# EAGLE design Infineo (EAGLE 6.6.0)
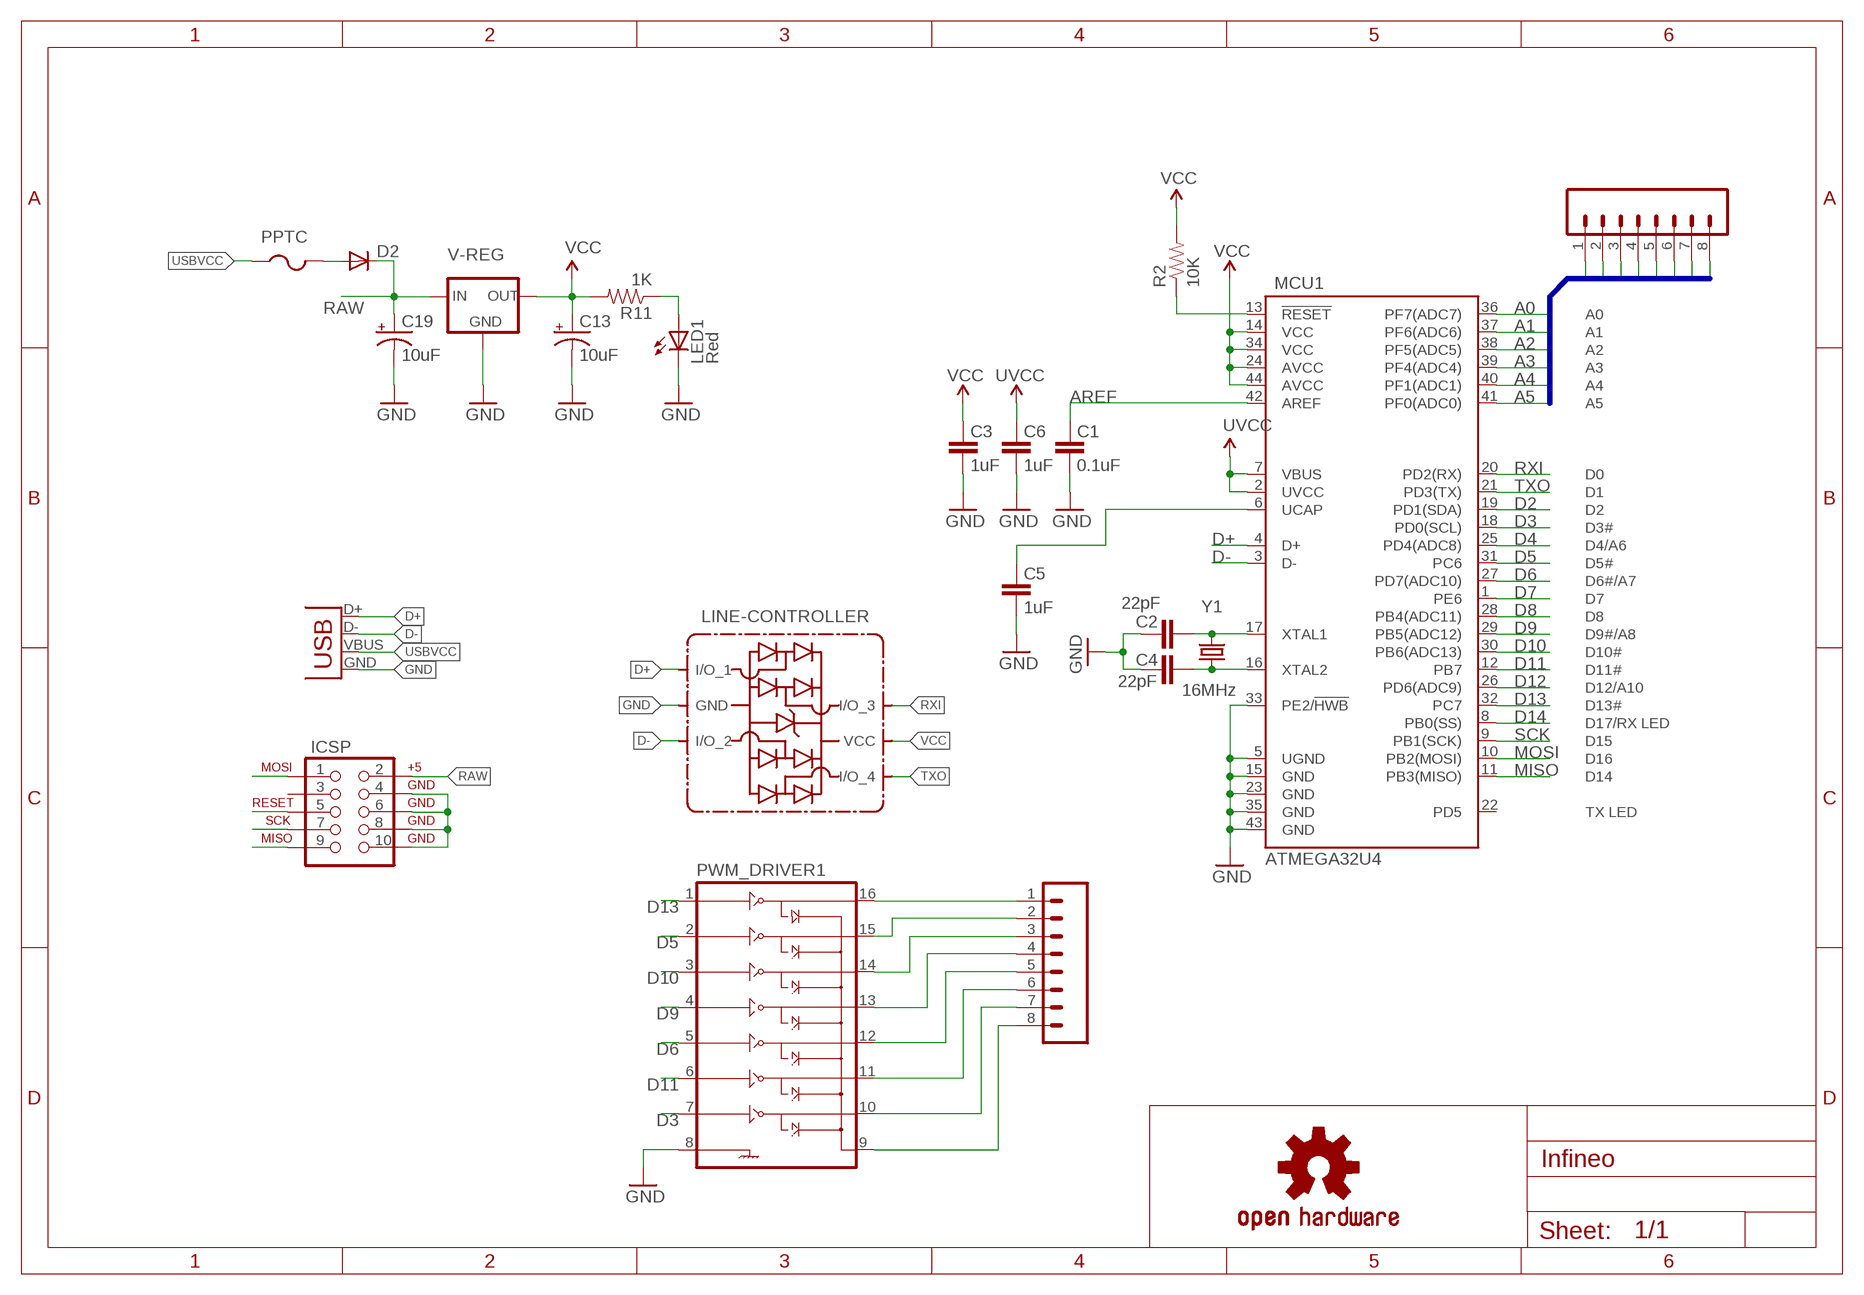
[diagram p0: schematic, sheet 1]

## Parts
C1  0.1uF  CAP0603-CAP  [0603-CAP]
C2  22pF  CAP0603-CAP  [0603-CAP]
C3  1uF  CAP0603-CAP  [0603-CAP]
C4  22pF  CAP0603-CAP  [0603-CAP]
C5  1uF  CAP0603-CAP  [0603-CAP]
C6  1uF  CAP0603-CAP  [0603-CAP]
C13  10uF  CAP_POL1206  [EIA3216]
C19  10uF  CAP_POL1206  [EIA3216]
D2  DIODESOD  [SOD-323]
ICSP  AVR_SPI_PROG2LOCK  [2X5-SHROUDED_LOCK]
JP1  M08LOCK_LONGPADS  [1X08_LOCK_LONGPADS]
JP3  M08LOCK_LONGPADS  [1X08_LOCK_LONGPADS]
LED1  Red  LED0603  [LED-0603]
LINE-CONTROLLER  SP3004_04XTG  [SOT-563]
MCU1  ATMEGA32U4  ATMEGA32U4TQFP  [SPARKFUN-DIGITALIC_TQFP44]
PPTC  PTCFUSE-1206  [R1206]
PWM_DRIVER1  IC_ULN2003-TSSOP-16  [TSSOP-16]
R2  10K  RESISTOR0603-RES  [0603-RES]
R11  1K  RESISTOR0603-RES  [0603-RES]
U$3  OSHW-LOGOS  [OSHW-LOGO-S]
V-REG  LM1117  [SOT223]
X3  USB-B-H  [USB-B-H]
Y1  16MHz  CRYSTALHC49UP  [HC49UP]

## Nets
3.3V: C3.2 ; supply symbol labelled VCC
!RESET: ICSP.5 MCU1.13(!RESET) R2.1
A0: JP1.2 MCU1.36(PF7(ADC7))
A1: JP1.3 MCU1.37(PF6(ADC6))
A2: JP1.4 MCU1.38(PF5(ADC5))
A3: JP1.5 MCU1.39(PF4(ADC4))
A4: JP1.6 MCU1.40(PF1(ADC1))
A5: JP1.7 MCU1.41(PF0(ADC0))
AREF: C1.2 MCU1.42(AREF)
D2: MCU1.19(PD1(SDA))
D3: MCU1.18(PD0(SCL)) PWM_DRIVER1.7(7B)
D4: MCU1.25(PD4(ADC8))
D5: MCU1.31(PC6) PWM_DRIVER1.2(2B)
D6: MCU1.27(PD7(ADC10)) PWM_DRIVER1.5(5B)
D7: MCU1.1(PE6)
D8: MCU1.28(PB4(ADC11))
D9: MCU1.29(PB5(ADC12)) PWM_DRIVER1.4(4B)
D10: MCU1.30(PB6(ADC13)) PWM_DRIVER1.3(3B)
D11: MCU1.12(PB7) PWM_DRIVER1.6(6B)
D12: MCU1.26(PD6(ADC9))
D13: MCU1.32(PC7) PWM_DRIVER1.1(1B)
D14: ICSP.9 MCU1.11(PB3(MISO))
D+: LINE-CONTROLLER.I/O_1 MCU1.4(D+) X3.D+
D-: LINE-CONTROLLER.I/O_2 MCU1.3(D-) X3.D-
GND [vcc]: C1.1 C2.2 C3.1 C4.2 C5.1 C6.1 C13.C(-) C19.C(-) ICSP.4 ICSP.6 ICSP.8 ICSP.10 JP1.8 LED1.C LINE-CONTROLLER.GND MCU1.5(UGND) MCU1.15(GND) MCU1.23(GND) MCU1.33(PE2/!HWB) MCU1.35(GND) MCU1.43(GND) PWM_DRIVER1.8(GND) V-REG.1(GND) X3.GND
MISO: MCU1.8(PB0(SS))
MOSI: ICSP.1 MCU1.10(PB2(MOSI))
N$1: C4.1 MCU1.16(XTAL2) Y1.1
N$2: C2.1 MCU1.17(XTAL1) Y1.2
N$3: D2.2(A) PPTC.2
N$4: C5.2 MCU1.6(UCAP)
N$9: JP3.1 PWM_DRIVER1.16(1C)
N$10: JP3.2 PWM_DRIVER1.15(2C)
N$11: JP3.3 PWM_DRIVER1.14(3C)
N$12: JP3.4 PWM_DRIVER1.13(4C)
N$13: JP3.5 PWM_DRIVER1.12(5C)
N$14: JP3.6 PWM_DRIVER1.11(6C)
N$15: JP3.7 PWM_DRIVER1.10(7C)
N$16: JP3.8 PWM_DRIVER1.9(COM)
N$38: LED1.A R11.1
RAW [vcc]: C19.A(+) D2.1(C) ICSP.2 V-REG.3(IN)
RXI: LINE-CONTROLLER.I/O_3 MCU1.20(PD2(RX))
SCK: ICSP.7 MCU1.9(PB1(SCK))
TXO: LINE-CONTROLLER.I/O_4 MCU1.21(PD3(TX))
USBVCC: PPTC.1 X3.VBUS
UVCC: C6.2 MCU1.2(UVCC) MCU1.7(VBUS)
VCC: C13.A(+) JP1.1 LINE-CONTROLLER.VCC MCU1.14(VCC) MCU1.24(AVCC) MCU1.34(VCC) MCU1.44(AVCC) R2.2 R11.2 V-REG.2(OUT)
Unconnected: ICSP.3 MCU1.22(PD5)

## Buses
A[0..5],VCC,GND

## Library data of the parts
C1-C6 = SparkFun:CAP: Capacitor Standard 0603 ceramic capacitor, and 0.1" leaded capacitor.
C13 C19 = SparkFun:CAP_POL: Capacitor Polarized These are standard SMD and PTH capacitors. Normally 10uF, 47uF, and 100uF in electrolytic and tantalum varieties. Always verify the external diameter of the through hole cap, it varies with capacity, voltage, and manufacturer. The EIA devices should be standard.
D2 = SparkFun:DIODE: Diode These are standard reverse protection diodes and small signal diodes. SMA package can handle up to about 1A. SOD-323 can handle about 200mA. What the SOD-323 package when ordering, there are some mfgs out there that are 5-pin packages.
ICSP = SparkFun:AVR_SPI_PROG2: AVR ICSP Header This is the standard AVR In Circuit Serial Programming header. Minimal, but includes pin one indicator. Works with standard Olimex programmers. Also look for the 6-pin reduced version. Spark Fun Electronics SKU: PRT-00778
JP1 JP3 = SparkFun-Connectors:M08: Header 8 Standard 8-pin 0.1" header. Use with straight break away headers (SKU : PRT-00116), right angle break away headers (PRT-00553), swiss pins (PRT-00743), machine pins (PRT-00117), and female headers (PRT-00115).
LED1 = SparkFun:LED: LEDs Standard schematic elements and footprints for 5mm, 3mm, 1206, and 0603 sized LEDs. 5mm - Spark Fun Electronics SKU : COM-00529 (and others)
LINE-CONTROLLER = SP3004:SP3004
MCU1 = SparkFun-Retired:ATMEGA32U4: Atmel 44-pin 8-bit Microcontroller with 32KBytes of ISP Flash and USB Controller ----- Please use the QFN-44-NOPAD_1:1 package for the footprint of all boards using a 32U4. Route traces directly away from the pads as much as possible.; PROD_ID: IC-11161
PPTC = adafruit:PTCFUSE: PTC fuses, resettable thermistors
PWM_DRIVER1 = dp_devices:IC_ULN2003: 7 Darlington Array Driver
R2 R11 = SparkFun:RESISTOR: Resistor Basic schematic elements and footprints for 0603, 1206, and PTH resistors.
U$3 = SparkFun:OSHW-LOGO: Open Source Hardware Logo This logo indicates the piece of hardware it is found on incorporates a OSHW license and/or adheres to the definition of open source hardware found here: http://freedomdefined.org/OSHW
V-REG = v-reg-2:LM1117
X3 = con-usb:USB: USB Connectors
Y1 = crystal:CRYSTAL: CRYSTAL; OC_FARNELL: unknown; OC_NEWARK: unknown

## Net classes
0 default: width 0.203 mm

## Board
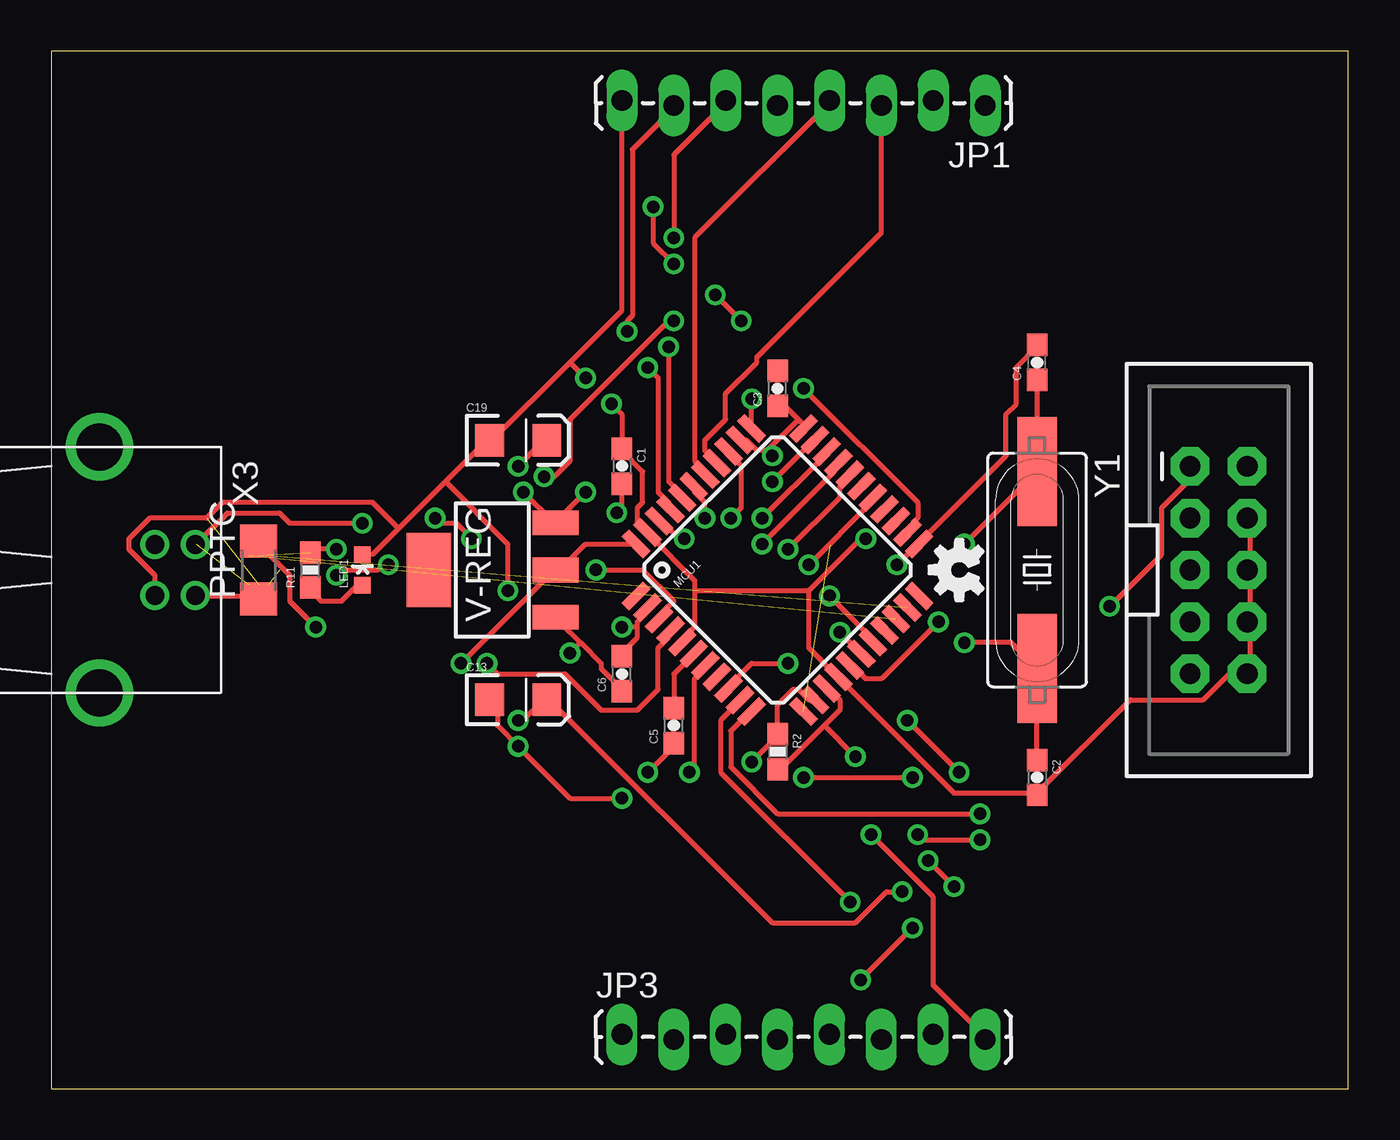
[diagram p1: board, top side]
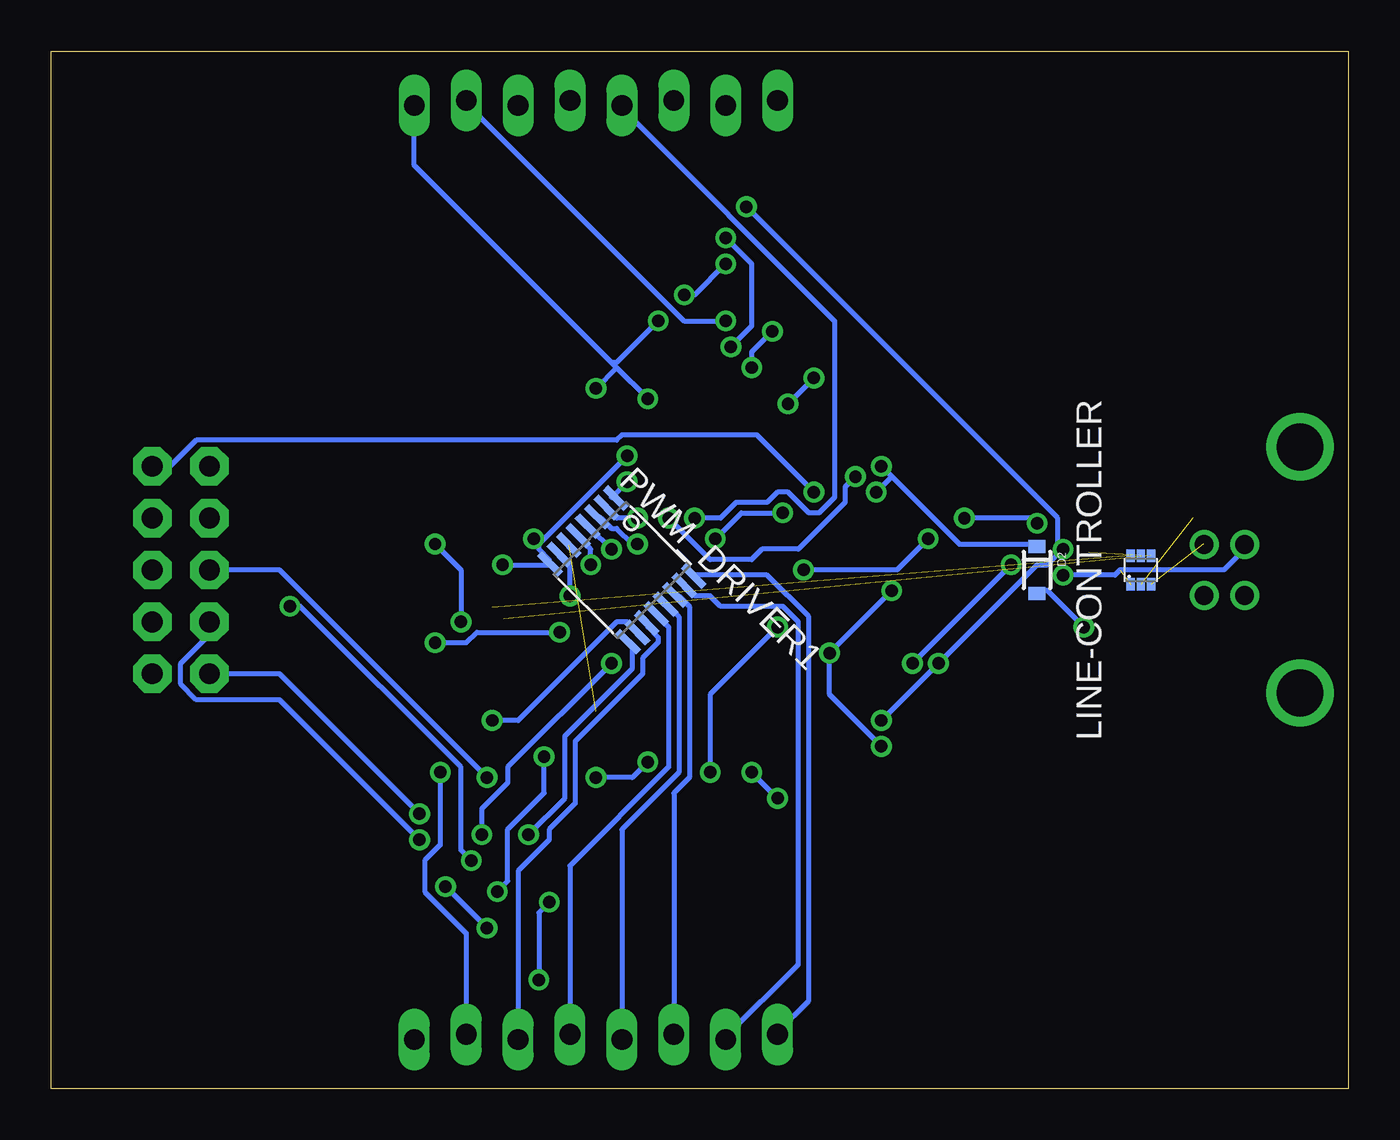
[diagram p2: board, bottom side, seen from below]

Size 63.5 x 50.8 mm. Coordinates in mm from the lower left corner, seen from the top.
Outline: 0,0 63.5,0 63.5,50.8 0,50.8 0,0
Copper layers (1*16): Top 0.035mm / dielectric 1.5mm / Bottom 0.035mm
Design rules "default": minimum track width 10mil, minimum drill 24mil, track to track 8mil, track to pad 8mil, pad to pad 8mil, via to via 8mil, smd to smd 8mil, copper to edge 40mil, drill to drill 8mil, minimum pad ring 10mil, minimum via ring 8mil, stop-mask expansion 4mil, vias tented up to drill 0mil, thermal gap 10mil

### Footprints (pad centres in the part's own frame; a part is rotated, then mirrored left to right if it is on the bottom)
0603-CAP = smd 1.1 x 1: 1 -0.85,0; 2 0.85,0
EIA3216 = smd 1.4 x 1.6: A 1.4,0; C -1.4,0
SOD-323 = smd 0.63 x 0.83: 1 -1.15,0; 2 1.15,0
2X5-SHROUDED_LOCK = drill 1.016 pad 1.88 octagon: 1 -1.397,5.08; 2 1.397,5.08; 3 -1.397,2.54; 4 1.397,2.54; 5 -1.397,0; 6 1.397,0; 7 -1.397,-2.54; 8 1.397,-2.54; 9 -1.397,-5.08; 10 1.397,-5.08
1X08_LOCK_LONGPADS = drill 1.016 long: 1 0,0.127; 2 2.54,-0.127; 3 5.08,0.127; 4 7.62,-0.127; 5 10.16,0.127; 6 12.7,-0.127; 7 15.24,0.127; 8 17.78,-0.127
LED-0603 = smd 0.8 x 0.8: A 0,-0.75; C 0,0.75
SOT-563 = smd 0.6 x 0.4: GND -0.7,0; I/O_1 -0.7,0.5; I/O_2 -0.7,-0.5; I/O_3 0.7,-0.5; I/O_4 0.7,0.5; VCC 0.7,0
SPARKFUN-DIGITALIC_TQFP44 = smd 1.5 x 0.5: 1 -5.8,4; 2 -5.8,3.2; 3 -5.8,2.4; 4 -5.8,1.6; 5 -5.8,0.8; 6 -5.8,0; 7 -5.8,-0.8; 8 -5.8,-1.6; 9 -5.8,-2.4; 10 -5.8,-3.2; 11 -5.8,-4; 23 5.8,-4; 24 5.8,-3.2; 25 5.8,-2.4; 26 5.8,-1.6; 27 5.8,-0.8; 28 5.8,0; 29 5.8,0.8; 30 5.8,1.6; 31 5.8,2.4; 32 5.8,3.2; 33 5.8,4 | smd 0.5 x 1.5: 12 -4,-5.8; 13 -3.2,-5.8; 14 -2.4,-5.8; 15 -1.6,-5.8; 16 -0.8,-5.8; 17 0,-5.8; 18 0.8,-5.8; 19 1.6,-5.8; 20 2.4,-5.8; 21 3.2,-5.8; 22 4,-5.8; 34 4,5.8; 35 3.2,5.8; 36 2.4,5.8; 37 1.6,5.8; 38 0.8,5.8; 39 0,5.8; 40 -0.8,5.8; 41 -1.6,5.8; 42 -2.4,5.8; 43 -3.2,5.8; 44 -4,5.8
R1206 = smd 1.6 x 1.803: 1 -1.422,0; 2 1.422,0
TSSOP-16 = smd 0.35 x 1.43: 1 -2.275,-2.7; 2 -1.625,-2.7; 3 -0.975,-2.7; 4 -0.325,-2.7; 5 0.325,-2.7; 6 0.975,-2.7; 7 1.625,-2.7; 8 2.275,-2.7; 9 2.275,2.7; 10 1.625,2.7; 11 0.975,2.7; 12 0.325,2.7; 13 -0.325,2.7; 14 -0.975,2.7; 15 -1.625,2.7; 16 -2.275,2.7
0603-RES = smd 1.1 x 1: 1 -0.85,0; 2 0.85,0
SOT223 = smd 1.219 x 2.235: 1 -2.311,-3.099; 2 0,-3.099; 3 2.311,-3.099 | smd 3.6 x 2.2: 4 0,3.099
USB-B-H = drill 0.914: D+ 0,1.25; D- 1.981,1.25; GND 0,-1.25; VBUS 1.981,-1.25 | drill 2.286: P$1 -2.718,-6.02; P$2 -2.718,6.02
HC49UP = smd 5.334 x 1.93: 1 -4.826,0; 2 4.826,0

### Placement (x,y rotation side)
C1  27.94,30.48 270 top
C2  48.26,15.24 270 top
C3  35.56,34.29 90 top
C4  48.26,35.56 90 top
C5  30.48,17.78 90 top
C6  27.94,20.32 90 top
C13  22.86,19.05 0 top
C19  22.86,31.75 0 top
D2  15.24,25.4 270 bottom
ICSP  57.15,25.4 0 top
JP1  45.72,48.26 180 top
JP3  27.94,2.54 0 top
LED1  15.24,25.4 0 top
LINE-CONTROLLER  10.16,25.4 90 bottom
MCU1  35.56,25.4 45 top
PPTC  10.16,25.4 90 top
PWM_DRIVER1  35.56,25.4 225 bottom
R2  35.56,16.51 270 top
R11  12.7,25.4 90 top
U$3  44.45,25.4 90 top
V-REG  21.59,25.4 90 top
X3  5.08,25.4 0 top
Y1  48.26,25.4 270 top

### Tracks (layer width: path | path; a pad name or v marks a point on that pad's centre or on a via)
!RESET  (via drill 0.61)
  Top 0.254: v36.83,15.24 v42.16,15.24 | v34.29,16 35.56,17.27 R2.1 35.56,18.8 36.32,19.56 36.58,19.56 37.08,19.05 37.34,19.05 MCU1.13
  Bottom 0.254: ICSP.5 52.32,25.4 v42.16,15.24 | v36.83,15.24 35.05,15.24 v34.29,16
A0  (via drill 0.61)
  Top 0.254: v33.27,27.94 33.78,28.45 33.78,30.48 33.27,30.99 MCU1.36 | v24.13,29.97 24.64,29.97 25.4,30.73 25.4,32.77 29.97,37.34 30.23,37.34 v30.48,37.59
  Bottom 0.254: v33.27,27.94 31.24,25.91 29.21,25.91 28.7,26.42 26.92,26.42 24.64,28.7 24.64,29.46 v24.13,29.97 | v30.48,37.59 32.51,37.59 43.18,48.26 JP1.2
A1
  Top 0.254: JP1.3 40.64,41.91 34.54,35.81 34.54,35.56 33.02,34.04 33.02,32.77 32,31.75 32,31.24 32.51,30.73 MCU1.37
A2
  Top 0.254: MCU1.38 32,30.23 31.5,30.73 31.5,41.66 38.1,48.26 JP1.4
A3  (via drill 0.61)
  Top 0.254: v32,27.94 32,28.7 31.5,29.21 31.5,29.46 MCU1.39
  Bottom 0.254: v32,27.94 30.73,27.94 29.97,28.7 28.45,28.7 27.94,29.21 27.43,29.21 26.42,28.19 25.91,28.19 25.15,28.96 25.15,37.59 35.56,48.01 JP1.5
A4  (via drill 0.61)
  Top 0.254: v30.23,36.32 30.23,29.72 30.99,28.96 MCU1.40 | v30.48,41.66 30.48,45.72 33.02,48.26 JP1.6
  Bottom 0.254: v30.23,36.32 29.21,37.34 29.21,40.39 v30.48,41.66
A5  (via drill 0.61)
  Top 0.254: v29.21,35.31 29.72,34.8 29.72,29.21 30.23,28.7 30.23,28.45 MCU1.41 | v28.19,37.08 28.19,37.59 28.45,37.85 28.45,45.97 30.48,48.01 JP1.7
  Bottom 0.254: v29.21,35.31 29.21,36.07 v28.19,37.08
AREF  (via drill 0.61)
  Top 0.254: C1.2 27.94,28.45 v27.69,28.19 | v30.99,26.92 30.73,26.92 29.97,27.69 MCU1.42
  Bottom 0.254: v27.69,28.19 29.72,28.19 v30.99,26.92
D3  (via drill 0.61)
  Top 0.254: v38.1,24.13 40.13,22.1 MCU1.18
  Bottom 0.254: v38.1,24.13 38.1,25.65 38.61,26.16 PWM_DRIVER1.7
D5  (via drill 0.61)
  Top 0.254: v34.8,27.94 37.85,30.99 MCU1.31
  Bottom 0.254: v34.8,27.94 35.81,27.94 36.32,28.45 PWM_DRIVER1.2
D6  (via drill 0.61)
  Top 0.254: v37.08,25.65 40.13,28.7 MCU1.27
  Bottom 0.254: v37.08,25.65 37.08,26.42 37.59,26.92 PWM_DRIVER1.5
D9  (via drill 0.61)
  Top 0.254: v36.07,26.42 38.61,28.96 38.61,29.46 39.12,29.97 MCU1.29
  Bottom 0.254: v36.07,26.42 37.08,27.43 PWM_DRIVER1.4
D10  (via drill 0.61)
  Top 0.254: v34.8,26.67 38.35,30.23 38.35,30.48 MCU1.30
  Bottom 0.254: v34.8,26.67 35.05,26.67 35.81,27.43 36.07,27.43 36.58,27.94 PWM_DRIVER1.3
D11  (1 unrouted)
D13  (via drill 0.61)
  Top 0.254: v35.31,29.72 37.34,31.75 MCU1.32
  Bottom 0.254: v35.31,29.72 36.07,28.96 PWM_DRIVER1.1
D14  (via drill 0.61)
  Top 0.254: v45.47,13.46 35.56,13.46 33.27,15.75 33.27,17.53 34.04,18.29 MCU1.11
  Bottom 0.254: ICSP.9 52.32,20.32 v45.47,13.46
D+  (via drill 0.61)  (1 unrouted)
  Top 0.254: v21.34,20.83 21.84,20.32 25.15,20.32 26.92,18.54 28.7,18.54 29.72,19.56 29.72,21.59 30.23,22.1 30.23,22.35 MCU1.4 | v16.51,25.65 16.26,25.65 16,25.4 14.22,25.4 v13.97,25.15
  Bottom 0.254: v16.51,25.65 v21.34,20.83 | v13.97,25.15 11.43,25.15 11.18,25.4 6.1,25.4 5.08,26.42 X3.D+
D-  (via drill 0.61)  (1 unrouted)
  Top 0.254: v26.67,25.4 28.96,25.4 30.48,23.88 29.97,23.37 29.97,23.11 MCU1.3 | v20.57,26.92 19.81,27.69 19.05,27.69 v18.8,27.94 | v15.24,27.69 11.68,27.69 11.18,28.19 8.64,28.19 7.11,26.67 X3.D-
  Bottom 0.254: v26.67,25.4 22.1,25.4 v20.57,26.92 | v18.8,27.94 15.49,27.94 v15.24,27.69
GND  (via drill 0.61)  (1 unrouted)
  Top 0.254: 36.58,32.77 36.83,32.51 MCU1.33 | 36.58,32.77 35.81,33.53 35.56,33.53 C3.1 | 35.05,31.24 34.54,31.24 34.04,31.75 33.78,31.75 MCU1.35 | 36.58,32.77 35.05,31.24 | C4.2 48.26,36.32 47.24,35.31 47.24,33.53 46.74,33.02 46.74,30.99 42.67,26.92 MCU1.23 42.42,26.67 v41.4,25.65 | v35.31,30.99 35.05,31.24 | 58.67,22.86 58.67,20.32 ICSP.10 57.66,20.32 56.39,19.05 52.83,19.05 48.26,14.48 | 58.67,25.4 58.67,27.94 ICSP.4 | 58.67,25.4 58.67,22.86 | 58.67,22.86 ICSP.8 | 58.67,25.4 ICSP.6 | 48.26,14.48 44.2,14.48 38.61,20.07 MCU1.15 38.35,20.32 37.08,21.59 37.08,24.38 | 48.26,14.48 C2.2 | v39.88,26.92 39.62,26.92 37.08,24.38 | 25.91,21.84 24.89,22.86 V-REG.1 | 25.91,21.84 26.92,20.83 26.92,20.57 27.94,19.56 C6.1 | v29.21,15.49 30.48,16.76 C5.1 | v27.94,14.22 25.4,14.22 v22.86,16.76 21.84,17.78 21.84,18.8 21.59,19.05 C13.C | v25.4,21.34 25.91,21.84 | 31.5,24.38 31.5,24.89 29.21,27.18 MCU1.43 28.96,27.43 28.7,27.69 28.7,28.45 28.96,28.7 28.96,30.23 27.94,31.24 C1.1 27.94,33.02 v27.43,33.53 | 31.5,24.38 31.5,22.61 30.99,22.1 MCU1.5 | JP1.8 27.94,38.1 25.4,35.56 | 25.4,35.56 21.59,31.75 C19.C 21.34,31.75 19.3,29.72 | 19.3,29.72 17.02,27.43 | 17.02,27.43 15.75,26.16 15.24,26.16 LED1.C | X3.GND 5.08,25.15 3.81,26.42 3.81,26.92 4.83,27.94 7.62,27.94 8.38,28.7 15.75,28.7 17.02,27.43 | 25.4,35.56 v26.16,34.8 | v22.35,24.38 22.35,26.67 19.3,29.72 | 31.5,24.38 37.08,24.38
  Bottom 0.254: v41.4,25.65 39.12,25.65 PWM_DRIVER1.8 39.12,25.91 39.62,26.42 39.62,26.67 | 39.62,26.67 v35.31,30.99 | v39.88,26.92 39.62,26.67 | v27.94,14.22 v29.21,15.49 | v22.86,16.76 25.4,19.3 v25.4,21.34 v22.35,24.38 | v26.16,34.8 v27.43,33.53
MOSI  (via drill 0.61)
  Top 0.254: v51.82,23.62 54.36,26.16 54.36,28.45 55.88,29.97 55.88,30.48 ICSP.1 | v44.2,9.91 v42.93,11.18 | v39.62,5.33 v42.16,7.87 | v39.12,9.14 32.77,15.49 32.77,18.03 33.53,18.8 MCU1.10
  Bottom 0.254: v51.82,23.62 51.31,23.62 43.43,15.75 43.43,11.68 v42.93,11.18 | v42.16,7.87 v44.2,9.91 | v39.62,5.33 39.62,8.64 v39.12,9.14
N$1  (via drill 0.61)
  Top 0.254: C4.1 Y1.1 v44.7,26.67 | v43.43,22.86 40.64,20.07 39.88,20.07 39.12,20.83 MCU1.16
  Bottom 0.254: v43.43,22.86 43.43,25.4 v44.7,26.67
N$2  (via drill 0.61)
  Top 0.254: C2.1 Y1.2 46.99,21.84 v44.7,21.84 | v38.61,22.35 39.62,21.34 MCU1.17
  Bottom 0.254: v38.61,22.35 42.67,22.35 43.18,21.84 v44.7,21.84
N$3  (via drill 0.61)
  Top 0.254: v12.95,22.61 11.68,23.88 11.68,25.15 10.16,26.67 PPTC.2
  Bottom 0.254: v12.95,22.61 14.73,24.38 15.24,24.38 D2.2
N$4
  Top 0.254: C5.2 30.48,20.32 MCU1.6
N$9
  Bottom 0.254: PWM_DRIVER1.16 32,25.15 28.45,25.15 26.42,23.11 26.42,4.32 27.94,2.79 JP3.1
N$10
  Bottom 0.254: PWM_DRIVER1.15 32.51,24.64 32,24.13 31.24,24.13 30.73,23.62 27.69,23.62 26.92,22.86 26.92,6.1 30.48,2.54 JP3.2
N$11
  Bottom 0.254: JP3.3 33.02,14.48 32.26,15.24 32.26,23.62 32.77,24.13 PWM_DRIVER1.14
N$12
  Bottom 0.254: JP3.4 35.56,12.7 32.77,15.49 32.77,23.11 33.27,23.62 PWM_DRIVER1.13
N$13
  Bottom 0.254: JP3.5 38.1,10.92 33.27,15.75 33.27,22.61 33.78,23.11 PWM_DRIVER1.12
N$14
  Bottom 0.254: JP3.6 40.64,10.67 39.12,12.19 39.12,12.7 37.85,13.97 37.85,17.02 34.54,20.32 34.54,21.08 33.78,21.84 33.78,22.1 34.29,22.61 PWM_DRIVER1.11
N$15  (via drill 0.61)
  Top 0.254: v41.91,18.03 v44.45,15.49
  Bottom 0.254: JP3.7 43.18,7.62 45.21,9.65 45.21,11.18 44.45,11.94 v44.45,15.49 | v41.91,18.03 40.64,18.03 35.81,22.86 35.31,22.86 34.8,22.35 PWM_DRIVER1.10
N$16  (via drill 0.61)
  Top 0.254: v40.13,12.45 43.18,9.4 43.18,5.08 45.72,2.54 JP3.8
  Bottom 0.254: v40.13,12.45 38.35,14.22 38.35,17.27 35.05,20.57 35.05,21.59 35.31,21.84 PWM_DRIVER1.9
N$38
  Top 0.254: LED1.A 15.24,24.64 14.99,24.64 14.22,23.88 13.21,23.88 12.7,24.38 R11.1
RAW  (via drill 0.61)
  Top 0.254: v22.86,30.48 24.13,31.75 C19.A | v23.11,29.21 24.64,27.69 V-REG.3 24.89,27.94 v26.16,29.21
  Bottom 0.254: v22.86,30.48 22.35,29.97 | 22.35,29.97 19.05,26.67 15.24,26.67 D2.1 | 22.35,29.97 v23.11,29.21 | ICSP.2 57.66,30.48 56.39,31.75 35.81,31.75 35.56,32 28.96,32 v26.16,29.21
RXI  (1 unrouted)
SCK  (via drill 0.61)
  Top 0.254: v45.47,12.19 42.67,12.19 v42.42,12.45 | v36.07,20.83 34.29,20.83 33.27,19.81 MCU1.9
  Bottom 0.254: v45.47,12.19 52.32,19.05 56.39,19.05 57.15,19.81 57.15,20.83 55.88,22.1 55.88,22.86 ICSP.7 | v42.42,12.45 42.42,13.72 41.15,14.99 41.15,15.75 v36.07,20.83
TXO  (1 unrouted)
USBVCC
  Top 0.254: PPTC.1 10.16,24.13 7.11,24.13 X3.VBUS
UVCC  (via drill 0.61)
  Top 0.254: 28.7,22.61 28.7,22.1 27.94,21.34 C6.2 | 28.7,22.61 28.7,22.86 28.96,23.11 28.96,23.37 MCU1.2 | v31.24,15.49 31.5,15.75 31.5,20.07 32,20.57 MCU1.7 | 28.7,22.61 v27.94,22.61
  Bottom 0.254: v31.24,15.49 31.24,19.3 v27.94,22.61
VCC  (via drill 0.61)  (1 unrouted)
  Top 0.254: v34.29,33.78 34.29,32.51 MCU1.34 | v36.83,34.29 42.42,28.7 42.42,27.94 42.16,27.69 42.16,27.43 MCU1.24 | MCU1.44 28.45,26.67 26.16,26.67 24.89,25.4 V-REG.2 24.64,25.4 v20.07,20.83 | 37.85,17.78 38.61,18.54 38.61,19.05 38.1,19.56 MCU1.14 | 37.85,17.78 35.81,15.75 35.56,15.75 R2.2 | v13.97,26.42 12.7,26.42 R11.2 | v22.86,18.03 23.11,18.03 24.13,19.05 C13.A 24.38,19.05 35.31,8.13 39.37,8.13 40.89,9.65 v41.66,9.65 | v39.37,16.26 37.85,17.78 | v32.51,38.86 v33.78,37.59 | v30.48,40.39 29.46,41.4 v29.46,43.18
  Bottom 0.254: JP1.1 45.72,45.21 36.07,35.56 | v34.29,33.78 35.81,35.31 | 35.81,35.31 36.07,35.56 | 35.81,35.31 v36.83,34.29 | v22.86,18.03 v20.07,20.83 15.24,25.65 14.73,25.65 v13.97,26.42 14.22,26.67 14.22,27.94 v29.46,43.18 | v39.37,16.26 39.37,14.48 41.15,12.7 41.15,10.16 v41.66,9.65 | 36.07,35.56 35.81,35.56 v33.78,37.59 | v32.51,38.86 32,38.86 v30.48,40.39